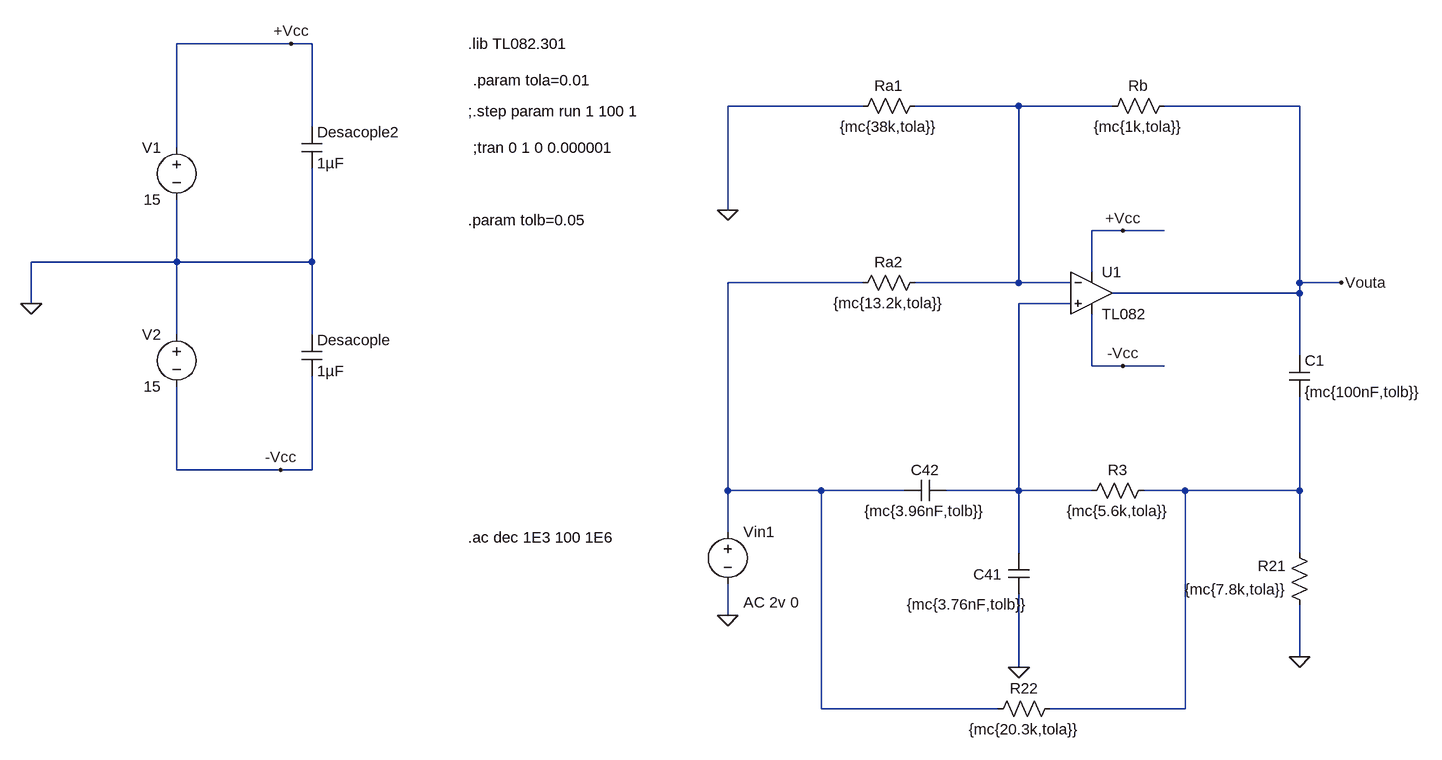
[diagram p0: schematic Sedra LPN.asc]
Sedra LPN.asc, the LTspice schematic file:
Version 4
SHEET 1 880 680
WIRE -2656 -1024 -2832 -1024
WIRE -2624 -1024 -2656 -1024
WIRE -1776 -928 -1984 -928
WIRE -1536 -928 -1696 -928
WIRE -1392 -928 -1536 -928
WIRE -1104 -928 -1312 -928
WIRE -2624 -896 -2624 -1024
WIRE -2832 -864 -2832 -1024
WIRE -1984 -768 -1984 -928
WIRE -1376 -736 -1424 -736
WIRE -1312 -736 -1376 -736
WIRE -2832 -688 -2832 -784
WIRE -2832 -688 -3056 -688
WIRE -2624 -688 -2624 -832
WIRE -2624 -688 -2832 -688
WIRE -1424 -672 -1424 -736
WIRE -1776 -656 -1984 -656
WIRE -1536 -656 -1536 -928
WIRE -1536 -656 -1696 -656
WIRE -1456 -656 -1536 -656
WIRE -1104 -656 -1104 -928
WIRE -1040 -656 -1104 -656
WIRE -1104 -640 -1104 -656
WIRE -1104 -640 -1392 -640
WIRE -3056 -624 -3056 -688
WIRE -1456 -624 -1536 -624
WIRE -2832 -576 -2832 -688
WIRE -2624 -576 -2624 -688
WIRE -1104 -544 -1104 -640
WIRE -1424 -528 -1424 -608
WIRE -1376 -528 -1424 -528
WIRE -1312 -528 -1376 -528
WIRE -2832 -368 -2832 -496
WIRE -2672 -368 -2832 -368
WIRE -2624 -368 -2624 -512
WIRE -2624 -368 -2672 -368
WIRE -1984 -336 -1984 -656
WIRE -1840 -336 -1984 -336
WIRE -1712 -336 -1840 -336
WIRE -1536 -336 -1536 -624
WIRE -1536 -336 -1648 -336
WIRE -1424 -336 -1536 -336
WIRE -1280 -336 -1344 -336
WIRE -1104 -336 -1104 -480
WIRE -1104 -336 -1280 -336
WIRE -1984 -272 -1984 -336
WIRE -1536 -240 -1536 -336
WIRE -1104 -240 -1104 -336
WIRE -1984 -144 -1984 -192
WIRE -1104 -80 -1104 -160
WIRE -1536 -64 -1536 -176
WIRE -1840 0 -1840 -336
WIRE -1568 0 -1840 0
WIRE -1280 0 -1280 -336
WIRE -1280 0 -1488 0
FLAG -3056 -624 0
FLAG -2656 -1024 +Vcc
FLAG -2672 -368 -Vcc
FLAG -1984 -768 0
FLAG -1376 -736 +Vcc
FLAG -1376 -528 -Vcc
FLAG -1984 -144 0
FLAG -1536 -64 0
FLAG -1040 -656 Vouta
FLAG -1104 -80 0
SYMBOL voltage -2832 -880 M0
WINDOW 123 0 0 Left 2
WINDOW 39 0 0 Left 2
SYMATTR InstName V1
SYMATTR Value 15
SYMBOL voltage -2832 -592 M0
WINDOW 123 0 0 Left 2
WINDOW 39 0 0 Left 2
SYMATTR InstName V2
SYMATTR Value 15
SYMBOL res -1680 -944 R90
WINDOW 0 0 56 VBottom 2
WINDOW 3 32 56 VTop 2
SYMATTR InstName Ra1
SYMATTR Value {mc{38k,tola}}
SYMBOL res -1296 -944 R90
WINDOW 0 0 56 VBottom 2
WINDOW 3 32 56 VTop 2
SYMATTR InstName Rb
SYMATTR Value {mc{1k,tola}}
SYMBOL Opamps\\opamp2 -1424 -704 R0
SYMATTR InstName U1
SYMATTR Value TL082
SYMBOL voltage -1984 -288 R0
WINDOW 123 24 124 Left 2
WINDOW 39 0 0 Left 2
WINDOW 3 24 152 Left 2
SYMATTR Value2 AC 2v 0
SYMATTR Value ""
SYMATTR InstName Vin1
SYMBOL cap -1648 -352 R90
WINDOW 0 0 32 VBottom 2
WINDOW 3 32 32 VTop 2
SYMATTR InstName C42
SYMATTR Value {mc{3.96nF,tolb}}
SYMBOL res -1680 -672 R90
WINDOW 0 0 56 VBottom 2
WINDOW 3 32 56 VTop 2
SYMATTR InstName Ra2
SYMATTR Value {mc{13.2k,tola}}
SYMBOL cap -2640 -896 R0
SYMATTR InstName Desacople2
SYMATTR Value 1µF
SYMBOL cap -2640 -576 R0
SYMATTR InstName Desacople
SYMATTR Value 1µF
SYMBOL cap -1520 -176 R180
WINDOW 0 42 31 Left 2
WINDOW 3 188 -15 Right 2
SYMATTR InstName C41
SYMATTR Value {mc{3.76nF,tolb}}
SYMBOL res -1440 -320 R270
WINDOW 0 32 56 VTop 2
WINDOW 3 0 56 VBottom 2
SYMATTR InstName R3
SYMATTR Value {mc{5.6k,tola}}
SYMBOL res -1584 16 R270
WINDOW 0 32 56 VTop 2
WINDOW 3 0 56 VBottom 2
SYMATTR InstName R22
SYMATTR Value {mc{20.3k,tola}}
SYMBOL res -1088 -144 R180
WINDOW 0 36 76 Left 2
WINDOW 3 36 40 Left 2
SYMATTR InstName R21
SYMATTR Value {mc{7.8k,tola}}
SYMBOL cap -1120 -544 R0
SYMATTR InstName C1
SYMATTR Value {mc{100nF,tolb}}
TEXT -2384 -1024 Left 2 !.lib TL082.301
TEXT -2384 -264 Left 2 !.ac dec 1E3 100 1E6
TEXT -2376 -968 Left 2 !.param tola=0.01
TEXT -2384 -920 Left 2 !;.step param run 1 100 1
TEXT -2376 -864 Left 2 !;tran 0 1 0 0.000001
TEXT -2384 -752 Left 2 !.param tolb=0.05

The netlist it stands for:
* Sedra LPN.asc
V1 +Vcc 0 15
V2 0 -Vcc 15
Ra1 N001 0 {mc{38k,tola}}
Rb Vouta N001 {mc{1k,tola}}
XU1 N003 N001 +Vcc -Vcc Vouta TL082  ; pins In+ In- V+ V- OUT
Vin1 N002 0 AC 2v 0
C42 N003 N002 {mc{3.96nF,tolb}}
Ra2 N001 N002 {mc{13.2k,tola}}
C§Desacople2 +Vcc 0 1µF
C§Desacople 0 -Vcc 1µF
C41 0 N003 {mc{3.76nF,tolb}}
R3 N003 N004 {mc{5.6k,tola}}
R22 N002 N004 {mc{20.3k,tola}}
R21 0 N004 {mc{7.8k,tola}}
C1 Vouta N004 {mc{100nF,tolb}}
.lib TL082.301
.ac dec 1E3 100 1E6
.param tola=0.01
;.step param run 1 100 1
;tran 0 1 0 0.000001
.param tolb=0.05
.backanno
.end